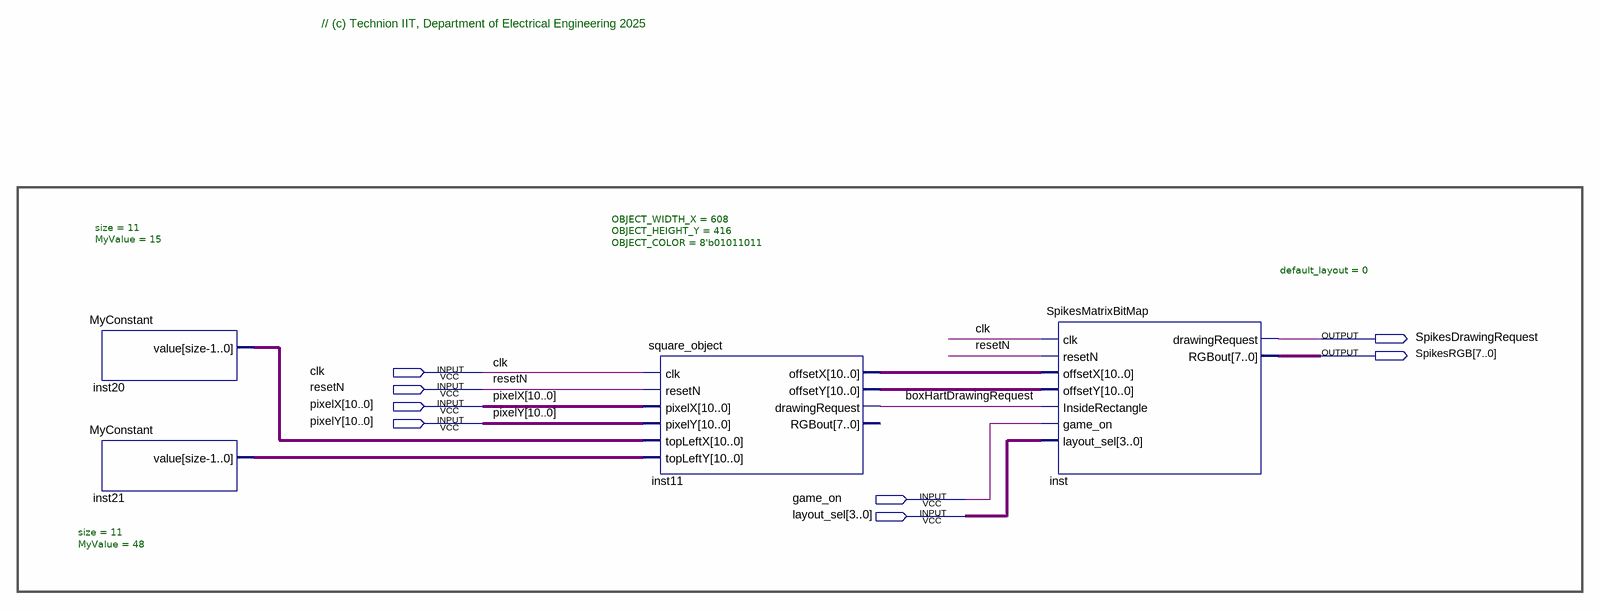
[diagram p0: schematic sheet]
// Quartus schematic Spikes_Block.bdf as structural Verilog: 4 symbols, 8 pins
module Spikes_Block (
  input  clk,
  input  resetN,
  input  [10:0] pixelX,
  input  [10:0] pixelY,
  input  game_on,
  input  [3:0] layout_sel,
  output SpikesDrawingRequest,
  output [7:0] SpikesRGB
);

  wire boxHartDrawingRequest;
  wire [10:0] inst11_offsetx, inst11_offsety, inst20_value, inst21_value;

  MyConstant #(.size(11), .MyValue(15)) inst20 (.value(inst20_value));
  MyConstant #(.size(11), .MyValue(48)) inst21 (.value(inst21_value));
  square_object #(.OBJECT_WIDTH_X(608), .OBJECT_HEIGHT_Y(416), .OBJECT_COLOR(8'b01011011)) inst11 (
    .clk(clk), .resetN(resetN), .pixelX(pixelX), .pixelY(pixelY), .topLeftX(inst20_value),
    .topLeftY(inst21_value), .offsetX(inst11_offsetx), .offsetY(inst11_offsety),
    .drawingRequest(boxHartDrawingRequest));  // open: RGBout
  SpikesMatrixBitMap #(.default_layout(0)) inst (
    .clk(clk), .resetN(resetN), .offsetX(inst11_offsetx), .offsetY(inst11_offsety),
    .InsideRectangle(boxHartDrawingRequest), .game_on(game_on), .layout_sel(layout_sel),
    .drawingRequest(SpikesDrawingRequest), .RGBout(SpikesRGB));

  // Notes on the sheet:
  //   // (c) Technion IIT, Department of Electrical Engineering 2025
endmodule
